# Altium schematic sheet Perf.SchDoc
size A4; SheetNumber: 9; SheetTotal: 11
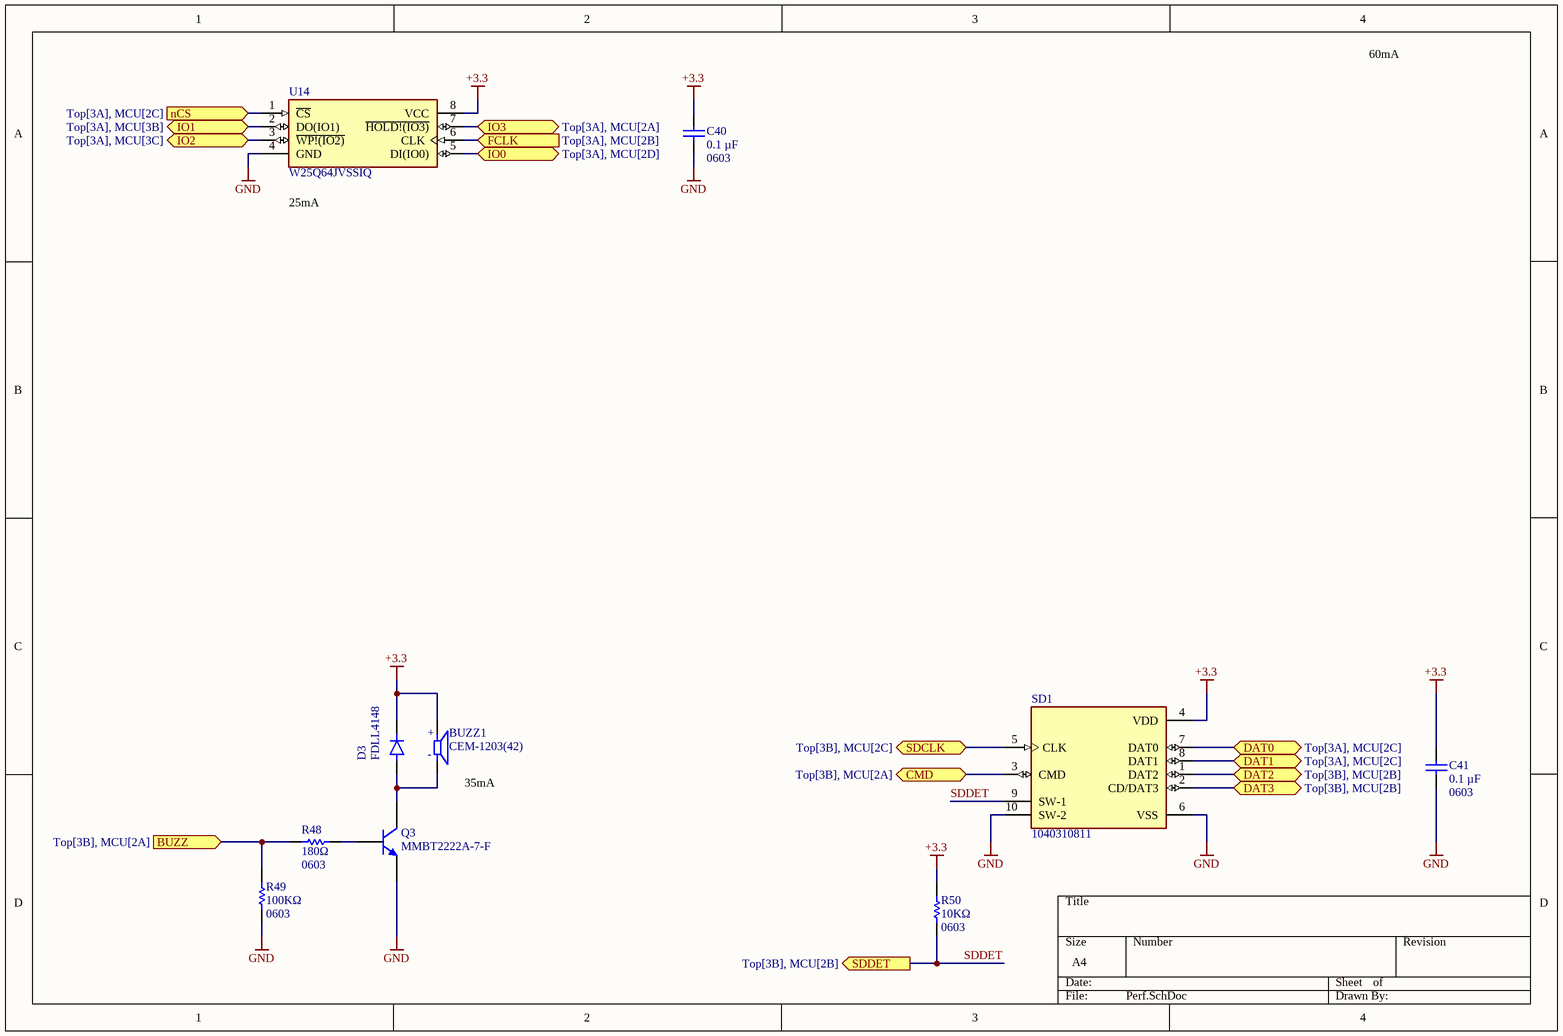
[diagram p0: Perf.SchDoc]

## Parts
BUZZ1  CEM-1203(42)  [Through Hole 12mm]
C40  value 0.1 µF  [0603]  (hidden comment: GRM188R72A104MA35J)
C41  value 0.1 µF  [0603]  (hidden comment: GRM188R72A104MA35J)
D3  FDLL4148  [SOD80]
Q3  MMBT2222A-7-F  [SOT-23-3]
R48  value 180Ω  [0603]  (hidden comment: RMCF0603FT180R)
R49  value 100KΩ  [0603]  (hidden comment: RMCF0603FG100K)
R50  value 10KΩ  [0603]  (hidden comment: RMCF0603FG10K0)
SD1  1040310811  [PCBComponent_1]
U14  W25Q64JVSSIQ  [8-SOIC]

## Ports
BUZZ (in, see Top[3B], MCU[2A]), CMD (bidir, see Top[3B], MCU[2A]), DAT0 (bidir, see Top[3A], MCU[2C]), DAT1 (bidir, see Top[3A], MCU[2C]), DAT2 (bidir, see Top[3B], MCU[2B]), DAT3 (bidir, see Top[3B], MCU[2B]), FCLK (in, see Top[3A], MCU[2B]), IO0 (bidir, see Top[3A], MCU[2D]), IO1 (bidir, see Top[3A], MCU[3B]), IO2 (bidir, see Top[3A], MCU[3C]), IO3 (bidir, see Top[3A], MCU[2A]), nCS (in, see Top[3A], MCU[2C]), SDCLK (bidir, see Top[3B], MCU[2C]), SDDET (out, see Top[3B], MCU[2B])

## Nets
+3.3: BUZZ1.P C40.1 C41.1 D3.C R50.2 SD1.4(VDD) U14.8(VCC)
GND: C40.2 C41.2 Q3.2(E) R49.2 SD1.6(VSS) SD1.10(SW-2) U14.4(GND)
BUZZ: R48.2 R49.1 ; port BUZZ
CMD: SD1.3(CMD) ; port CMD
DAT0: SD1.7(DAT0) ; port DAT0
DAT1: SD1.8(DAT1) ; port DAT1
DAT2: SD1.1(DAT2) ; port DAT2
DAT3: SD1.2(CD/DAT3) ; port DAT3
FCLK: U14.6(CLK) ; port FCLK
IO0: U14.5(DI(IO0)) ; port IO0
IO1: U14.2(DO(IO1)) ; port IO1
IO2: U14.3(~{WP!(IO2)}) ; port IO2
IO3: U14.7(~{HOLD!(IO3)}) ; port IO3
nCS: U14.1(~{CS}) ; port nCS
SDCLK: SD1.5(CLK) ; port SDCLK
SDDET: R50.1 SD1.9(SW-1) ; port SDDET
NetBUZZ1_N: BUZZ1.N D3.A Q3.3(C)
NetQ3_1: Q3.1(B) R48.1

## Notes on the sheet
- 60mA
- (near U14) 25mA
- (near BUZZ1) 35mA
- (in symbol CEM-1203(42)) +; -

## Library data of the parts
BUZZ1 = CEM-1203(42): Buzzers Transducer, Externally Driven Magnetic 3.5 V 35mA 2.048kHz 85dB @ 3.5V, 10cm Through Hole PC Pins; Voltage: 3.5V; Frequency: 2.048KHz
C40 C41 = GRM188R72A104MA35J: 0.1 µF ±20% 100V Ceramic Capacitor X7R 0603 (1608 Metric); Case: 0603; Tolerance: ±20%; Temperature Coefficient: X7R; Voltage: 100V
D3 = FDLL4148: Diode 100 V 200mA Surface Mount SOD-80; DC Reverse: 100V; Forward: 1V @ 10mA; Reverse Recovery Time: 4ns; Average Rectified: 200mA
Q3 = MMBT2222A-7-F: Bipolar (BJT) Transistor NPN 40 V 600 mA 300MHz 310 mW Surface Mount SOT-23-3
R48 = RMCF0603FT180R: 180 Ohms ±1% 0.1W, 1/10W Chip Resistor 0603 (1608 Metric) Automotive AEC-Q200 Thick Film; Case: 0603; Tolerance: 1%; Power: 0.1W
R49 = RMCF0603FG100K: 100 kOhms ±1% 0.1W, 1/10W Chip Resistor 0603 (1608 Metric) Automotive AEC-Q200 Thick Film; Case: 0603; Tolerance: 1%; Power: 0.1W
R50 = RMCF0603FG10K0: 10 kOhms ±1% 0.1W, 1/10W Chip Resistor 0603 (1608 Metric) Automotive AEC-Q200 Thick Film; Case: 0603; Tolerance: 1%; Power: 0.1W
SD1 = 1040310811: 10 (8 + 2) Position Card Connector Secure Digital - microSD™ Surface Mount, Right Angle Gold; pin to pad: 6>6+G1+G2+G3+G4
U14 = W25Q64JVSSIQ: FLASH - NOR Memory IC 64Mbit SPI - Quad I/O 133 MHz 8-SOIC